# Altium project MB1360.PrjPcb (part 1 of 2)
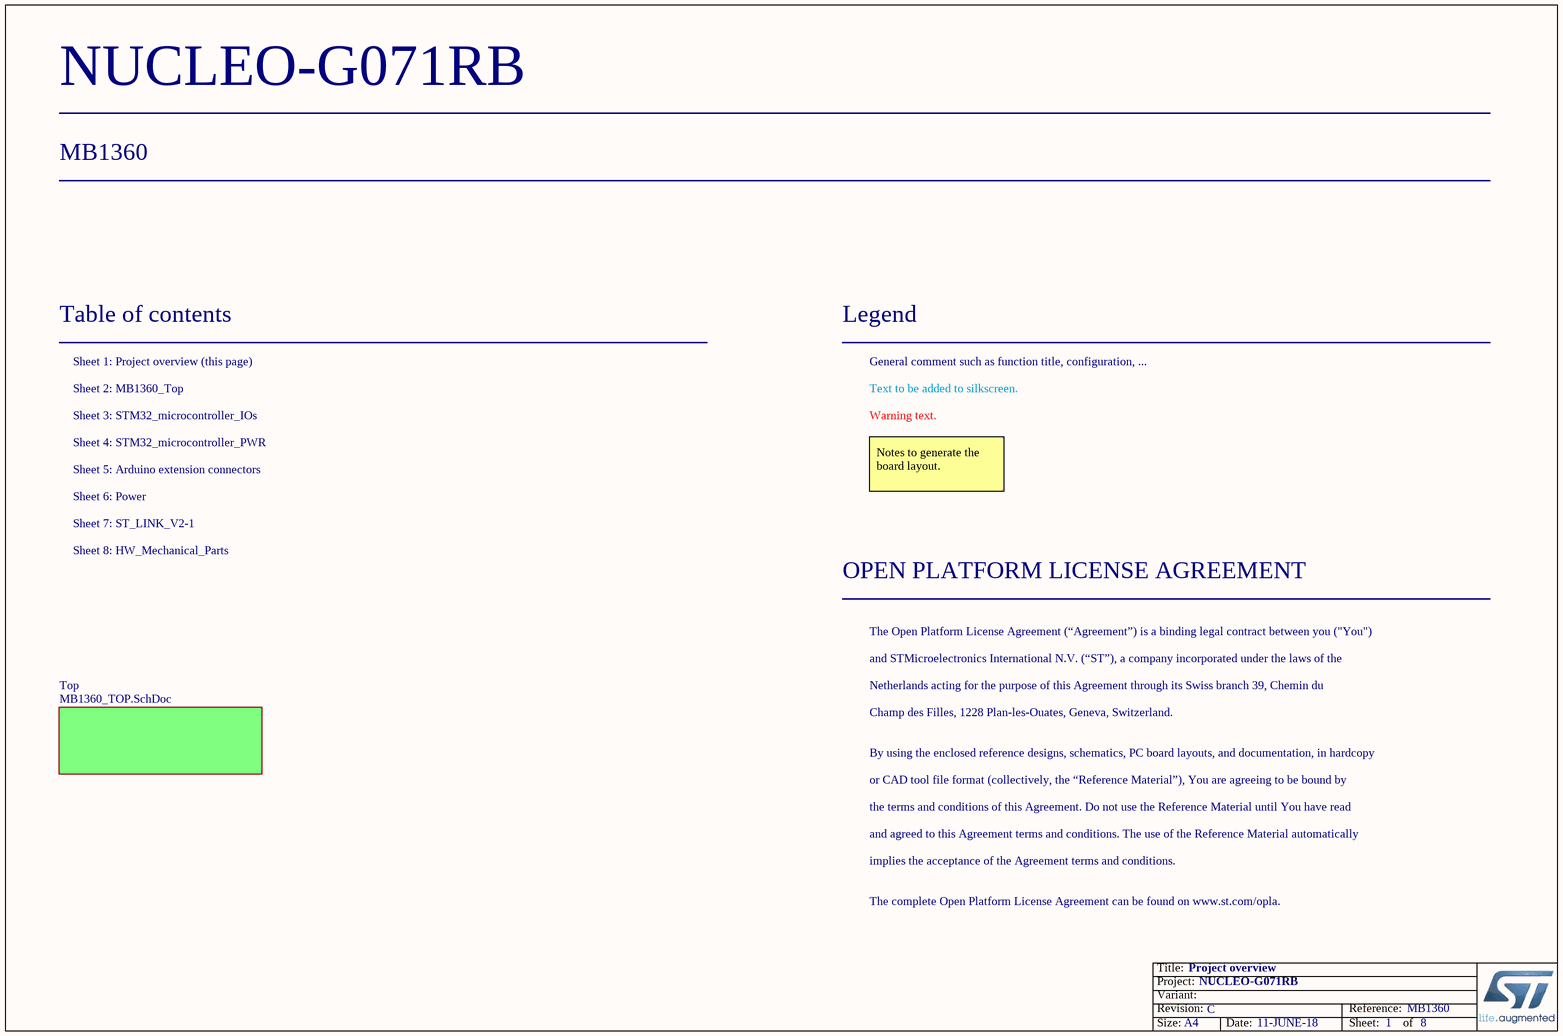
[diagram p0: Project_overview.SchDoc]
Board_Assembly_Revision: 01; Board_Document_Date: 11-JUNE-18; Board_Name: NUCLEO-G071RB; Board_PCB_Revision: C; Board_Reference: MB1360
8 sheets, 149 parts. Net scope: flat (ports and power ports of the same name join across sheets).
Board file: MB1360.PcbDoc
Sheets:
  Project_overview.SchDoc
    Top = MB1360_TOP.SchDoc
      ST_LINK_V2-1 = ST_LINK_V2-1.SchDoc
      Connectors = Arduino_extension_connectors.SchDoc
      MCU = STM32_microcontroller_IOs.SchDoc
      Power = Power.SchDoc
      STM32_microcontroller_power = STM32_microcontroller_power.SchDoc
      HW_Mechanical_Parts = HW_Mechanical_Parts.SchDoc

## Sheet Project_overview.SchDoc: Project overview
size A4; Date: Not used; ApprovedBy: Not used; CheckedBy: Not used; Author: Not used; CompanyName: STMicroelectronics; DrawnBy: Not used; Engineer: Not used; Organization: Not used; Address1: Not used; Address2: Not used; Address3: Not used; Address4: Not used; DocumentNumber: 1; Revision: Not used; SheetNumber: 1; SheetTotal: 8; CurrentTime: Not used; CurrentDate: Not used; Time: Not used; DocumentFullPathAndName: Not used; DocumentName: Not used; ModifiedDate: Not used; ImagePath: Not used; ProjectName: Not used; Application_BuildNumber: Not used

### Sub-sheets
Top = MB1360_TOP.SchDoc: no entries

### Notes on the sheet
- Table of contents
- Sheet 1: Project overview (this page)
- Legend
- General comment such as function title, configuration, ...
- Sheet 2: MB1360_Top
- Sheet 4: STM32_microcontroller_PWR
- Sheet 3: STM32_microcontroller_IOs
- Text to be added to silkscreen.
- Warning text.
- Sheet 6: Power
- Sheet 5: Arduino extension connectors
- Notes to generate the board layout.
- Sheet 7: ST_LINK_V2-1
- Sheet 8: HW_Mechanical_Parts
- OPEN PLATFORM LICENSE AGREEMENT
- The Open Platform License Agreement (“Agreement”) is a binding legal contract between you ("You")
- and STMicroelectronics International N.V. (“ST”), a company incorporated under the laws of the
- Netherlands acting for the purpose of this Agreement through its Swiss branch 39, Chemin du
- Champ des Filles, 1228 Plan-les-Ouates, Geneva, Switzerland.
- By using the enclosed reference designs, schematics, PC board layouts, and documentation, in hardcopy
- or CAD tool file format (collectively, the “Reference Material”), You are agreeing to be bound by
- the terms and conditions of this Agreement. Do not use the Reference Material until You have read
- and agreed to this Agreement terms and conditions. The use of the Reference Material automatically
- implies the acceptance of the Agreement terms and conditions.
- The complete Open Platform License Agreement can be found on www.st.com/opla.
- Title:
- Project:
- Size:
- Revision:
- Variant:
- A4
- Date:
- Reference:
- Sheet:
- of

## Sheet MB1360_TOP.SchDoc: TOP
size A4; CompanyName: STMicroelectronics; Organization: Microcontrollers Division; SheetNumber: 2; SheetTotal: 8
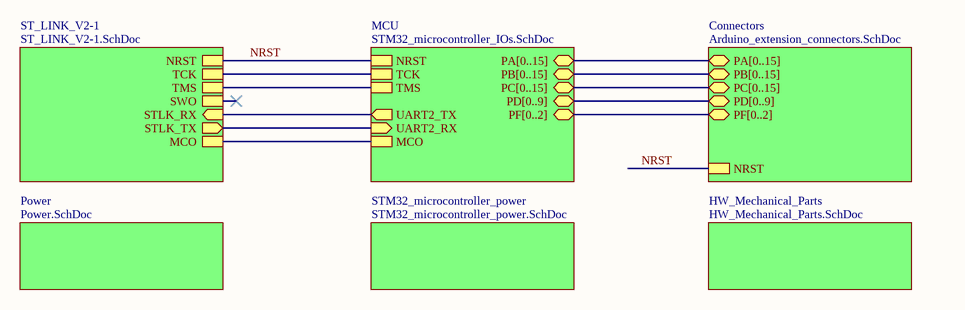
[diagram p1: MB1360_TOP.SchDoc]

### Sub-sheets
Connectors = Arduino_extension_connectors.SchDoc: PA[0..15] (bidir), PB[0..15] (bidir), PC[0..15] (bidir), NRST, PD[0..9], PF[0..2] (bidir)
HW_Mechanical_Parts = HW_Mechanical_Parts.SchDoc: no entries
MCU = STM32_microcontroller_IOs.SchDoc: NRST, MCO, UART2_RX (in), UART2_TX (out), PA[0..15] (bidir), PB[0..15] (bidir), PC[0..15] (bidir), TCK, TMS, PD[0..9], PF[0..2] (bidir)
Power = Power.SchDoc: no entries
ST_LINK_V2-1 = ST_LINK_V2-1.SchDoc: TMS, TCK, MCO, NRST, STLK_RX (in), STLK_TX (out), SWO
STM32_microcontroller_power = STM32_microcontroller_power.SchDoc: no entries

### Nets
NRST: sheet ST_LINK_V2-1/NRST, sheet Connectors/NRST, sheet MCU/NRST
(unnamed): sheet ST_LINK_V2-1/TMS, sheet MCU/TMS
(unnamed): sheet ST_LINK_V2-1/TCK, sheet MCU/TCK
(unnamed): sheet ST_LINK_V2-1/MCO, sheet MCU/MCO
(unnamed): sheet ST_LINK_V2-1/STLK_RX, sheet MCU/UART2_TX
(unnamed): sheet ST_LINK_V2-1/STLK_TX, sheet MCU/UART2_RX

### Buses and harness runs
bus sheet Connectors/PA[0..15] = sheet MCU/PA[0..15]
bus sheet Connectors/PB[0..15] = sheet MCU/PB[0..15]
bus sheet Connectors/PC[0..15] = sheet MCU/PC[0..15]
bus sheet Connectors/PD[0..9] = sheet MCU/PD[0..9]
bus sheet Connectors/PF[0..2] = sheet MCU/PF[0..2]

### Notes on the sheet
- Title:
- Project:
- Size:
- Revision:
- Variant:
- A4
- Date:
- Reference:
- Sheet:
- of

## Sheet ST_LINK_V2-1.SchDoc: ST_LINK_V2-1
size A4; CompanyName: STMicroelectronics; Organization: Microcontrollers Division; SheetNumber: 7; SheetTotal: 8
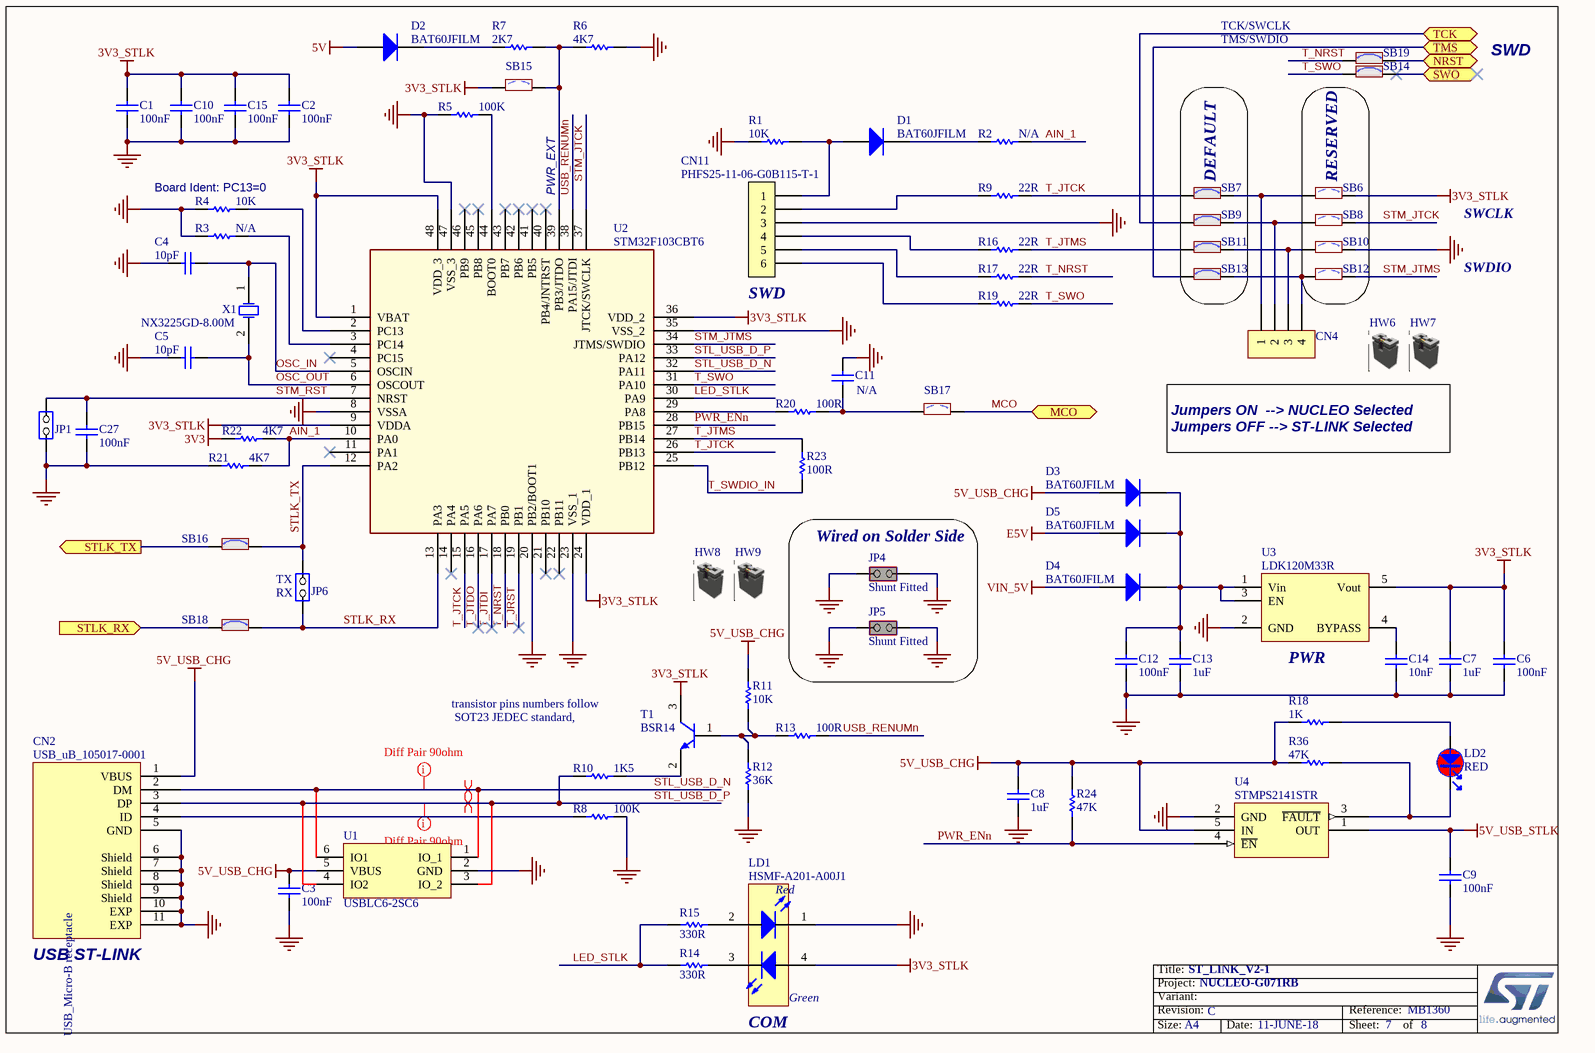
[diagram p2: ST_LINK_V2-1.SchDoc]

### Parts
C1  value 100nF  [C0603]  (hidden comment: Capacitor)
C2  value 100nF  [C0603]  (hidden comment: Capacitor)
C3  value 100nF  [C0603]  (hidden comment: Capacitor)
C4  value 10pF  [C0603]  (hidden comment: Capacitor)
C5  value 10pF  [C0603]  (hidden comment: Capacitor)
C6  value 100nF  [C0603]  (hidden comment: Capacitor)
C7  value 1uF  [C0603]  (hidden comment: Capacitor)
C8  value 1uF  [C0603]  (hidden comment: Capacitor)
C9  value 100nF  [C0603]  (hidden comment: Capacitor)
C10  value 100nF  [C0603]  (hidden comment: Capacitor)
C11  N/A  [C0603]
C12  value 100nF  [C0603]  (hidden comment: Capacitor)
C13  value 1uF  [C0603]  (hidden comment: Capacitor)
C14  value 10nF  [C0603]  (hidden comment: Capacitor)
C15  value 100nF  [C0603]  (hidden comment: Capacitor)
C27  value 100nF  [C0603]  (hidden comment: Capacitor)
CN2  value USB_uB_105017-0001  [CON_USBMICROB_MOLEX_105017-0001_H2P90]  (hidden comment: USB_uB_105017.0001)
CN4  Header 4x1  [CON_988-JIUBABA_PHFS25-11-04-G0B115-T-1]  (value not drawn)
CN11  Manufacturer_Part_Number: PHFS25-11-06-G0B115-T-1  [CON_988-JIUBABA_PHFS25-11-06-G0B115-T-1]  (hidden comment: Header 6x1)
D1  BAT60JFILM  [DIO_SOD323]
D2  BAT60JFILM  [DIO_SOD323]
D3  BAT60JFILM  [DIO_SOD323]
D4  BAT60JFILM  [DIO_SOD323]
D5  BAT60JFILM  [DIO_SOD323]
HW6  Shunt 2.54mm  [N/A]  (value not drawn)  (mechanical)
HW7  Shunt 2.54mm  [N/A]  (value not drawn)  (mechanical)
HW8  Shunt 2.54mm  [N/A]  (value not drawn)  (mechanical)
HW9  Shunt 2.54mm  [N/A]  (value not drawn)  (mechanical)
JP1  Jumper Header 2x1  [CON_SAMTEC_TSW-102-07-G-S]  (value not drawn)
JP4  Shunt Fitted  [CON_SAMTEC_TSW-102-07-G-S]
JP5  Shunt Fitted  [CON_SAMTEC_TSW-102-07-G-S]
JP6  Jumper Header 2x1  [CON_SAMTEC_TSW-102-07-G-S]  (value not drawn)
LD1  Manufacturer_Part_Number: HSMF-A201-A00J1  [LED_BI-GR_HSMF-A201-A00J1]  (hidden comment: LD_BICOLOR_CMS)
LD2  value RED  [LED_0603_RED]  (hidden comment: LED_red)
R1  value 10K  [R0603]  (hidden comment: Resistor)
R2  N/A  [R0603]
R3  N/A  [R0603]
R4  value 10K  [R0603]  (hidden comment: Resistor)
R5  value 100K  [R0603]  (hidden comment: Resistor)
R6  value 4K7  [R0603]  (hidden comment: Resistor)
R7  value 2K7  [R0603]  (hidden comment: Resistor)
R8  value 100K  [R0603]  (hidden comment: Resistor)
R9  value 22R  [R0603]  (hidden comment: Resistor)
R10  value 1K5  [R0603]  (hidden comment: Resistor)
R11  value 10K  [R0603]  (hidden comment: Resistor)
R12  value 36K  [R0603]  (hidden comment: Resistor)
R13  value 100R  [R0603]  (hidden comment: Resistor)
R14  value 330R  [R0603]  (hidden comment: Resistor)
R15  value 330R  [R0603]  (hidden comment: Resistor)
R16  value 22R  [R0603]  (hidden comment: Resistor)
R17  value 22R  [R0603]  (hidden comment: Resistor)
R18  value 1K  [R0603]  (hidden comment: Resistor)
R19  value 22R  [R0603]  (hidden comment: Resistor)
R20  value 100R  [R0603]  (hidden comment: Resistor)
R21  value 4K7  [R0603]  (hidden comment: Resistor)
R22  value 4K7  [R0603]  (hidden comment: Resistor)
R23  value 100R  [R0603]  (hidden comment: Resistor)
R24  value 47K  [R0603]  (hidden comment: Resistor)
R36  value 47K  [R0603]  (hidden comment: Resistor)
SB6  SB_OFF  [SOLDER-BRIDGE_R0603-0R]  (value not drawn)
SB7  SB_ON  [SOLDER-BRIDGE_R0603-0R]  (value not drawn)
SB8  SB_OFF  [SOLDER-BRIDGE_R0603-0R]  (value not drawn)
SB9  SB_ON  [SOLDER-BRIDGE_R0603-0R]  (value not drawn)
SB10  SB_OFF  [SOLDER-BRIDGE_R0603-0R]  (value not drawn)
SB11  SB_ON  [SOLDER-BRIDGE_R0603-0R]  (value not drawn)
SB12  SB_OFF  [SOLDER-BRIDGE_R0603-0R]  (value not drawn)
SB13  SB_ON  [SOLDER-BRIDGE_R0603-0R]  (value not drawn)
SB14  SB_ON  [SOLDER-BRIDGE_R0603-0R]  (value not drawn)
SB15  SB_OFF  [SOLDER-BRIDGE_R0603-0R]  (value not drawn)
SB16  SB_ON  [SOLDER-BRIDGE_R0603-0R]  (value not drawn)
SB17  SB_OFF  [SOLDER-BRIDGE_R0603-0R]  (value not drawn)
SB18  SB_ON  [SOLDER-BRIDGE_R0603-0R]  (value not drawn)
SB19  SB_ON  [SOLDER-BRIDGE_R0603-0R]  (value not drawn)
T1  Manufacturer_Part_Number: BSR14  [NPN_SOT23]  (hidden comment: 9013-SOT23)
U1  USBLC6-2SC6  [ESD_SOT23-6L]
U2  STM32F103CBT6  [ICC_LQFP48_7X7_P050]
U3  LDK120M33R  [REG_SOT23-5L]
U4  value STMPS2141STR  [MOS_SOT23-5L]  (hidden comment: DFN8 and SO8 are mixed in a single footprint allowing to swap according to components availability)
X1  value NX3225GD-8.00M  [CRY_NX3225GD_2P]  (hidden comment: XTAL_8M_NX3225GD)

### Blocks framed on the sheet
DEFAULT: SB7 SB9 SB11 SB13
RESERVED: SB6 SB8 SB10 SB12
Wired on Solder Side: JP4 JP5

### Ports
MCO, NRST, STLK_RX (in), STLK_TX (out), SWO, TCK, TMS

### Nets
3V3: R22.1
3V3_STLK: C1.2 C2.2 C6.2 C7.2 C10.2 C15.2 LD1.4(YellowGreen_anode) SB6.2 SB15.1 T1.3(C) U2.1(VBAT) U2.9(VDDA) U2.24(VDD_1) U2.36(VDD_2) U2.48(VDD_3) U3.5(Vout)
5V: D2.1(A)
5V_USB_CHG: C3.2 C8.1 CN2.1(VBUS) D3.1(A) R11.2 R18.2 R24.2 R36.2 U1.5(VBUS) U4.5(IN)
5V_USB_STLK: C9.2 U4.1(OUT)
E5V: D5.1(A)
GND: C1.1 C2.1 C3.1 C4.1 C5.1 C6.1 C7.1 C8.2 C9.1 C10.1 C11.2 C12.1 C13.1 C14.1 C15.1 C27.2 CN2.5(GND) CN2.6(Shield) CN2.7(Shield) CN2.8(Shield) CN2.9(Shield) CN2.10(EXP) CN2.11(EXP) CN11.3 JP1.2(NO) JP4.1(COMMON) JP4.2(NO) JP5.1(COMMON) JP5.2(NO) LD1.1(RED_cathode) R1.2 R3.1 R4.1 R5.1 R6.2 R8.2 R12.1 R21.1 SB10.2 U1.2(GND) U2.8(VSSA) U2.20(PB2/BOOT1) U2.23(VSS_1) U2.35(VSS_2) U2.47(VSS_3) U3.2(GND) U4.2(GND)
VIN_5V: D4.1(A)
AIN_1: R2.2 R21.2 R22.2 U2.10(PA0)
LED_STLK: R14.1 R15.1 U2.30(PA9)
MCO: SB17.2 ; port MCO
NRST: SB19.2 ; port NRST
OSC_IN: C4.2 U2.5(OSCIN) X1.1(OSC1)
OSC_OUT: C5.2 U2.6(OSCOUT) X1.2(OSC2)
PA13: SB13.1 ; port TMS
PA14: SB9.1 ; port TCK
PWR_ENn: R24.1 U2.28(PB15) U4.4(~{EN})
STL_USB_D_N: CN2.2(DM) U1.1(IO_1) U1.6(IO1) U2.32(PA11)
STL_USB_D_P: CN2.3(DP) R10.1 U1.3(IO_2) U1.4(IO2) U2.33(PA12)
STLK_RX: JP6.1(COMMON) SB18.2 U2.13(PA3)
STLK_TX: JP6.2(NO) SB16.2 U2.12(PA2)
STM_JTCK: SB8.2 U2.37(JTCK/SWCLK)
STM_JTMS: SB12.2 U2.34(JTMS/SWDIO)
STM_RST: C27.1 JP1.1(COMMON) U2.7(NRST)
T_JRST: U2.19(PB1)
T_JTCK: R9.2 SB7.1 U2.15(PA5) U2.26(PB13)
T_JTDI: U2.17(PA7)
T_JTDO: U2.16(PA6)
T_JTMS: R16.2 R23.2 SB11.1 U2.27(PB14)
T_NRST: R17.2 SB19.1 U2.18(PB0)
T_SWDIO_IN: R23.1 U2.25(PB12)
T_SWO: R19.2 SB14.1 U2.31(PA10)
USB_RENUMn: R13.2 U2.38(PA15/JTDI)
NetC11_1: C11.1 R20.2 SB17.1
NetC12_2: C12.2 C13.2 D3.2(K) D4.2(K) D5.2(K) U3.1(Vin) U3.3(EN)
NetC14_2: C14.2 U3.4(BYPASS)
NetCN2_4: CN2.4(ID) R8.1
NetCN4_1: CN4.1 SB6.1 SB7.2
NetCN4_2: CN4.2 SB8.1 SB9.2
NetCN4_3: CN4.3 SB10.1 SB11.2
NetCN4_4: CN4.4 SB12.1 SB13.2
NetCN11_1: CN11.1 D1.1(A) R1.1
NetCN11_2: CN11.2 R9.1
NetCN11_4: CN11.4 R16.1
NetCN11_5: CN11.5 R17.1
NetCN11_6: CN11.6 R19.1
NetD1_2: D1.2(K) R2.1
NetD2_2: D2.2(K) R7.1
NetLD1_2: LD1.2(Red_anode) R15.2
NetLD1_3: LD1.3(YellowGreen_cathode) R14.2
NetLD2_1: LD2.1 R18.1
NetLD2_2: LD2.2 R36.1 U4.3(~{FAULT})
NetR3_2: R3.2 U2.3(PC14)
NetR4_2: R4.2 U2.2(PC13)
NetR5_2: R5.2 U2.44(BOOT0)
NetR6_1: R6.1 R7.2 SB15.2 U2.39(PB3/JTDO)
NetR10_2: R10.2 T1.2(E)
NetR11_1: R11.1 R12.2 R13.1 T1.1(B)
NetR20_1: R20.1 U2.29(PA8)
NetSB14_2: SB14.2 ; port SWO
NetSB16_1: SB16.1 ; port STLK_TX
NetSB18_1: SB18.1 ; port STLK_RX

Not connected (* = marked no-connect by the designer): U2 4(PC15)* 11(PA1)* 14(PA4)* 21(PB10)* 22(PB11)* 40(PB4/JNTRST)* 41(PB5)* 42(PB6)* 43(PB7)* 45(PB8)* 46(PB9)*

### Layout directives
mark named Diff Pair 90ohm: STL_USB_D_N, STL_USB_D_P
differential pair: STL_USB_D_N, STL_USB_D_P

### Notes on the sheet
- TCK/SWCLK
- TMS/SWDIO
- SWD
- (near R4) Board Ident: PC13=0
- PWR_EXT
- SWCLK
- (near CN11) SWD
- SWDIO
- Jumpers ON  --> NUCLEO Selected
  Jumpers OFF --> ST-LINK Selected
- (near JP6) TX
- (near JP6) RX
- (near U3) PWR
- (near T1) transistor pins numbers follow
  SOT23 JEDEC standard,
- (near CN2) USB ST-LINK
- COM
- Title:
- Project:
- Size:
- Revision:
- Variant:
- A4
- Date:
- Reference:
- Sheet:
- of
- (in symbol MCD-00028) USB_Micro-B receptacle
- (in symbol MCD-00051) Red; Green

### Library data of the parts
C1-C3 C6 C9 C10 C12 C15 C27 = MCD-00211: Capacitor, MLCC, 100nF, 16V, X7R, 10%, 0603, T=0,8mm; Manufacturer_Part_Number: CC0603KRX7R7BB104; Manufacturer: YAGEO; Provided_By: Subcon; Initial_Board_Reference: mb1319; Internal_Part_Number: MCD-00211; Status: Released; Part_Type: Capacitor; Package: C0603; ComponentLink1Description: Yageo_Capacitor_X7R-series.pdf; ComponentLink1URL: http://tunmcdsvn.tun.st.com/Component_Datasheet_Library/Trunk/Capacitors/Yageo_Capacitor_X7R-series.pdf; ECCN_US: n/a; ECCN_EU: n/a
C4 C5 = MCD-00637: Capacitor, MLCC, 10pF, 50V, NPO, 5%, 0603, T=0,8mm; Manufacturer_Part_Number: CC0603JRNPO9BN100; Manufacturer: YAGEO; Provided_By: subcon; Initial_Board_Reference: mb1319; Internal_Part_Number: MCD-00637; Status: Released; Part_Type: Capacitor; Package: C0603; ComponentLink1Description: Yageo_Capacitor_NP0_16V-to-50V.pdf; ComponentLink1URL: http://tunmcdsvn.tun.st.com/Component_Datasheet_Library/Trunk/Capacitors/Yageo_Capacitor_NP0_16V-to-50V.pdf; ECCN_US: n/a; ECCN_EU: n/a
C7 C13 = MCD-00010: Capacitor, MLCC, 1uF, 16V, X5R, 10%, 0603, T=0,8mm; Manufacturer_Part_Number: CC0603KRX5R7BB105; Manufacturer: YAGEO; Provided_By: Subcon; Initial_Board_Reference: mb1274; Internal_Part_Number: MCD-00010; Status: Released; Part_Type: Capacitor; Package: C0603; ComponentLink1Description: Yageo_Capacitor_X5R-series.pdf; ComponentLink1URL: http://tunmcdsvn.tun.st.com/Component_Datasheet_Library/Trunk/Capacitors/Yageo_Capacitor_X5R-series.pdf; ECCN_US: n/a; ECCN_EU: n/a
C8 = MCD-00238: Capacitor, MLCC, 1uF, 6V3, X5R, 10%, 0603, T=0,8mm; Manufacturer_Part_Number: CC0603KRX5R5BB105; Manufacturer: YAGEO; Provided_By: Subcon; Initial_Board_Reference: mb1319; Internal_Part_Number: MCD-00238; ECCN_US: n/a; ECCN_EU: n/a; ComponentLink1Description: Yageo_Capacitor_X5R-series.pdf; Status: Released; Part_Type: Capacitor; Package: C0603; ComponentLink1URL: http://tunmcdsvn.tun.st.com/Component_Datasheet_Library/Trunk/Capacitors/Yageo_Capacitor_X5R-series.pdf
C11 = MCD-00638: Capacitor, MLCC, 20pF, 50V, NPO, 5%, 0603, T=0,8mm; Manufacturer_Part_Number: CC0603JRNPO9BN200; Manufacturer: YAGEO; Provided_By: Subcon; Initial_Board_Reference: mb1319; Internal_Part_Number: MCD-00638; Value: 20pF; Status: Released; Part_Type: Capacitor; Package: C0603; ComponentLink1Description: Yageo_Capacitor_NP0_16V-to-50V.pdf; ECCN_US: n/a; ECCN_EU: n/a; ComponentLink1URL: http://tunmcdsvn.tun.st.com/Component_Datasheet_Library/Trunk/Capacitors/Yageo_Capacitor_NP0_16V-to-50V.pdf
C14 = MCD-00017: Capacitor, MLCC, 10nF, 50V, X7R, 10%, 0603, T=0.8mm; Manufacturer_Part_Number: CC0603KRX7R9BB103; Manufacturer: YAGEO; Provided_By: Subcon; Initial_Board_Reference: mb1274; Internal_Part_Number: MCD-00017; Status: Released; Part_Type: Capacitor; Package: C0603; ComponentLink1Description: Yageo_Capacitor_X7R-series.pdf; ComponentLink1URL: http://tunmcdsvn.tun.st.com/Component_Datasheet_Library/Trunk/Capacitors/Yageo_Capacitor_X7R-series.pdf; ECCN_US: n/a; ECCN_EU: n/a
CN2 = MCD-00028: USB-MICRO-B, 0.65mm, RA, SMT, Bottom Mount,; Part_Type: Connector; Manufacturer_Part_Number: 1050170001; Manufacturer: MOLEX; Provided_By: Subcon; Initial_Board_Reference: mb1274; Internal_Part_Number: MCD-00028; Status: Released; ComponentLink1Description: Molex_Connector-USB-microB_105017-0001.pdf; ComponentLink1URL: http://tunmcdsvn.tun.st.com/Component_Datasheet_Library/Trunk/Connectors/Molex_Connector-USB-microB_105017-0001.pdf; ECCN_US: n/a; ECCN_EU: n/a
CN4 = MCD-00313: Header, 4x1, 2.54mm, VR, TH, Height 6mm/3mm; Part_Type: Connector; Manufacturer_Part_Number: PHFS25-11-04-G0B115-T-1; Manufacturer: JIUBABA; Provided_By: Subcon; Initial_Board_Reference: mb1311; Internal_Part_Number: MCD-00313; Value: Header 4x1; Status: Released; ComponentLink1Description: Juibaba_PHFS25-11XXXXXXXXXX.pdf; ComponentLink1URL: http://tunmcdsvn.tun.st.com/Component_Datasheet_Library/Trunk/Connectors/Juibaba_PHFS25-11XXXXXXXXXX.pdf; ECCN_US: n/a; ECCN_EU: n/a
CN11 = MCD-00316: Header, 6x1, 2.54mm, VR, TH, Height 6mm/3mm; Part_Type: Connector; Manufacturer: JIUBABA; Value: Header 1x6; Provided_By: Subcon; Initial_Board_Reference: mb1311; Internal_Part_Number: MCD-00316; Status: Released; ComponentLink1Description: Juibaba_PHFS25-11XXXXXXXXXX.pdf; ComponentLink1URL: http://tunmcdsvn.tun.st.com/Component_Datasheet_Library/Trunk/Connectors/Juibaba_PHFS25-11XXXXXXXXXX.pdf; ECCN_US: n/a; ECCN_EU: n/a
D1 D3-D5 = MCD-00034: Part_Type: Diode; Manufacturer: STMICROELECTRONICS; ECCN_US: EAR99; ECCN_EU: NEC; Provided_By: Subcon; Initial_Board_Reference: mb1274; Internal_Part_Number: MCD-00034; Value: BAT60JFILM; Status: Released; Manufacturer_Part_Number: BAT60JFILM; ComponentLink1Description: STM_Diode_BAT60JFILM-SOD323.pdf; ComponentLink1URL: http://tunmcdsvn.tun.st.com/Component_Datasheet_Library/Trunk/Diodes/STM_Diode_BAT60JFILM-SOD323.pdf
D2 = MCD-00034: Manufacturer: STMICROELECTRONICS; Part_Type: Diode; ECCN_US: EAR99; ECCN_EU: NEC; Provided_By: Subcon; Initial_Board_Reference: mb1274; Internal_Part_Number: MCD-00034; Value: BAT60JFILM; Manufacturer_Part_Number: BAT60JFILM; ComponentLink1Description: STM_Diode_BAT60JFILM-SOD323.pdf; Status: Released
HW6-HW9 = MCD-00043: SHUNT 2.54mm BLACK; Manufacturer_Part_Number: SNT-100-BK-G; Manufacturer: SAMTEC; Provided_By: Subcon; Internal_Part_Number: MCD-00043; PartType: Mechanical; ECCN_US: n/a; ECCN_EU: n/a; ComponentLink1Description: Samtec_Shunt_Jumper_SNT100.pdf
JP1 JP6 = MCD-00045: Header, 2x1, 2,54mm, VR, TH, Height 5.84mm/2.54mm; Part_Type: Connector; Manufacturer_Part_Number: TSW-102-07-x-S; Manufacturer: SAMTEC; Value: Jumper_Header_2x1; Provided_By: Subcon; Initial_Board_Reference: mb1274; Internal_Part_Number: MCD-00045; Status: Released; ComponentLink1Description: Samtec_connector_TSW-HTSW-series.pdf; ComponentLink1URL: http://tunmcdsvn.tun.st.com/Component_Datasheet_Library/Trunk/Connectors/Samtec_connector_TSW-HTSW-series.pdf; ECCN_US: n/a; ECCN_EU: n/a
JP4 JP5 = MCD-00683: Header, 2x1, 2,54mm, VR, TH, Height 5.84mm/2.54mm - Shunt Fitted by default; Part_Type: Connector; Manufacturer_Part_Number: TSW-102-07-x-S; Manufacturer: SAMTEC; Provided_By: Subcon; Initial_Board_Reference: MB1331; Internal_Part_Number: MCD-00683; Value: Shunt Fitted; Status: Released; ComponentLink1Description: Samtec_connector_TSW-HTSW-series.pdf; ComponentLink1URL: http://tunmcdsvn.tun.st.com/Component_Datasheet_Library/Trunk/Connectors/Samtec_TSW-HTSW-series; ECCN_US: n/a; ECCN_EU: n/a
LD1 = MCD-00051: LED Bicolor; Part_Type: Display; Manufacturer: AVAGO TECHNOLOGIES; Alternate_Manufacturer_Part_Number: LE-RGW35280; Alternate_Manufacturer: EVERLUCK; ECCN_US: EAR99; ECCN_EU: NEC; Provided_By: Subcon; Initial_Board_Reference: mb1274; Internal_Part_Number: MCD-00051; Value: LD_BICOLOR_CMS; Status: Released; ComponentLink1Description: Avago_LED-SMC_HSMx-A2xx-02Feb2012.pdf; ComponentLink1URL: http://tunmcdsvn.tun.st.com/Component_Datasheet_Library/Trunk/display/Avago_LED-SMC_HSMx-A2xx-02Feb2012.pdf
LD2 = MCD-00049: LED, Red, 0603; Manufacturer_Part_Number: 19-213-R6C-AP1Q2B/3T; Manufacturer: EVERLIGHT; Part_Type: Display; ECCN_US: EAR99; ECCN_EU: NEC; Provided_By: Subcon; Initial_Board_Reference: mb1274; Internal_Part_Number: MCD-00049; ComponentLink1Description: Everlight_SMD-LED-RED_19-213-R6C-AP1Q2B-3T-V3.doc.pdf; Status: Released; ComponentLink1URL: http://tunmcdsvn.tun.st.com/Component_Datasheet_Library/Trunk/display/Everlight_SMD-LED-RED_19-213-R6C-AP1Q2B-3T-V3.doc.pdf
R1 R3 R4 R11 = MCD-00220: Resistor,10K,0603,1%,1/10W; Manufacturer_Part_Number: RC0603FR-0710KL; Manufacturer: YAGEO; Provided_By: Subcon; Initial_Board_Reference: mb1319; Internal_Part_Number: MCD-00220; Status: Released; Part_Type: Resistor; Package: R0603; ComponentLink1Description: Yageo_Resistor_RC0603-series.pdf; ComponentLink1URL: http://tunmcdsvn.tun.st.com/Component_Datasheet_Library/Trunk/Resistors/Yageo_Resistor_RC0603-series.pdf; ECCN_US: n/a; ECCN_EU: n/a
  R3: Value: 10K
R2 R9 R16 R17 R19 = MCD-00066: Resistor,22R,0603,1%,1/10W; Manufacturer_Part_Number: RC0603FR-0722RL; Manufacturer: YAGEO; Provided_By: Subcon; Initial_Board_Reference: mb1274; Internal_Part_Number: MCD-00066; Status: Released; Part_Type: Resistor; Package: R0603; ComponentLink1Description: Yageo_Resistor_RC0603-series.pdf; ComponentLink1URL: http://tunmcdsvn.tun.st.com/Component_Datasheet_Library/Trunk/Resistors/Yageo_Resistor_RC0603-series.pdf; ECCN_US: n/a; ECCN_EU: n/a
  R2: Value: 22R
R5 R8 = MCD-00223: Resistor,100K,0603,1%,1/10W; Manufacturer_Part_Number: RC0603FR-07100KL; Manufacturer: YAGEO; Provided_By: Subcon; Initial_Board_Reference: mb1319; Internal_Part_Number: MCD-00223; Status: Released; Part_Type: Resistor; Package: R0603; ComponentLink1Description: Yageo_Resistor_RC0603-series.pdf; ComponentLink1URL: http://tunmcdsvn.tun.st.com/Component_Datasheet_Library/Trunk/Resistors/Yageo_Resistor_RC0603-series.pdf; ECCN_US: n/a; ECCN_EU: n/a
R6 R21 R22 = MCD-00219: Resistor,4K7,0603,1%,1/10W; Manufacturer_Part_Number: RC0603FR-074K7L; Manufacturer: YAGEO; Provided_By: Subcon; Initial_Board_Reference: mb1319; Internal_Part_Number: MCD-00219; Status: Released; Part_Type: Resistor; Package: R0603; ComponentLink1Description: Yageo_Resistor_RC0603-series.pdf; ComponentLink1URL: http://tunmcdsvn.tun.st.com/Component_Datasheet_Library/Trunk/Resistors/Yageo_Resistor_RC0603-series.pdf; ECCN_US: n/a; ECCN_EU: n/a
R7 = MCD-00218: Resistor,2K7,0603,1%,1/10W; Manufacturer_Part_Number: RC0603FR-072K7L; Manufacturer: YAGEO; Provided_By: Subcon; Initial_Board_Reference: mb1319; Internal_Part_Number: MCD-00218; Status: Released; Part_Type: Resistor; Package: R0603; ComponentLink1Description: Yageo_Resistor_RC0603-series.pdf; ComponentLink1URL: http://tunmcdsvn.tun.st.com/Component_Datasheet_Library/Trunk/Resistors/Yageo_Resistor_RC0603-series.pdf; ECCN_US: n/a; ECCN_EU: n/a
R10 = MCD-00217: Resistor,1K5,0603,1%,1/10W; Manufacturer_Part_Number: RC0603FR-071K5L; Manufacturer: YAGEO; Provided_By: Subcon; Initial_Board_Reference: mb1319; Internal_Part_Number: MCD-00217; Status: Released; Part_Type: Resistor; Package: R0603; ComponentLink1Description: Yageo_Resistor_RC0603-series.pdf; ComponentLink1URL: http://tunmcdsvn.tun.st.com/Component_Datasheet_Library/Trunk/Resistors/Yageo_Resistor_RC0603-series.pdf; ECCN_US: n/a; ECCN_EU: n/a
R12 = MCD-00221: Resistor,36K,0603,1%,1/10W; Manufacturer_Part_Number: RC0603FR-0736KL; Manufacturer: YAGEO; Provided_By: Subcon; Initial_Board_Reference: mb1319; Internal_Part_Number: MCD-00221; Status: Released; Part_Type: Resistor; Package: R0603; ComponentLink1Description: Yageo_Resistor_RC0603-series.pdf; ComponentLink1URL: http://tunmcdsvn.tun.st.com/Component_Datasheet_Library/Trunk/Resistors/Yageo_Resistor_RC0603-series.pdf; ECCN_US: n/a; ECCN_EU: n/a
R13 R20 R23 = MCD-00224: Resistor,100R,0603,1%,1/10W; Manufacturer_Part_Number: RC0603FR-07100RL; Manufacturer: YAGEO; Provided_By: Subcon; Initial_Board_Reference: mb1319; Internal_Part_Number: MCD-00224; Status: Released; Part_Type: Resistor; Package: R0603; ComponentLink1Description: Yageo_Resistor_RC0603-series.pdf; ComponentLink1URL: http://tunmcdsvn.tun.st.com/Component_Datasheet_Library/Trunk/Resistors/Yageo_Resistor_RC0603-series.pdf; ECCN_US: n/a; ECCN_EU: n/a
R14 R15 = MCD-00197: Resistor,330R,0603,1%,1/10W; Manufacturer_Part_Number: RC0603FR-07330RL; Manufacturer: YAGEO; Provided_By: Subcon; Internal_Part_Number: MCD-00197; Status: Released; Part_Type: Resistor; Package: R0603; ComponentLink1Description: Yageo_Resistor_RC0603-series.pdf; ComponentLink1URL: http://tunmcdsvn.tun.st.com/Component_Datasheet_Library/Trunk/Resistors/Yageo_Resistor_RC0603-series; ECCN_US: n/a; ECCN_EU: n/a
R18 = MCD-00070: Resistor,1K,0603,1%,1/10W; Manufacturer_Part_Number: RC0603FR-071KL; Manufacturer: YAGEO; Provided_By: Subcon; Initial_Board_Reference: mb1274; Internal_Part_Number: MCD-00070; Status: Released; Part_Type: Resistor; Package: R0603; ComponentLink1Description: Yageo_Resistor_RC0603-series.pdf; ComponentLink1URL: http://tunmcdsvn.tun.st.com/Component_Datasheet_Library/Trunk/Resistors/Yageo_Resistor_RC0603-series.pdf; ECCN_US: n/a; ECCN_EU: n/a
R24 R36 = MCD-00222: Resistor,47K,0603,1%,1/10W; Manufacturer_Part_Number: RC0603FR-0747KL; Manufacturer: YAGEO; Provided_By: Subcon; Initial_Board_Reference: MB1319; Internal_Part_Number: MCD-00222; Status: Released; Part_Type: Resistor; Package: R0603; ComponentLink1Description: Yageo_Resistor_RC0603-series.pdf; ComponentLink1URL: http://tunmcdsvn.tun.st.com/Component_Datasheet_Library/Trunk/Resistors/Yageo_Resistor_RC0603-series; ECCN_US: n/a; ECCN_EU: n/a
SB6 SB8 SB10 SB12 SB15 SB17 = MCD-00072: Solder Bridge OFF; Part_Type: Mechanical; Initial_Board_Reference: mb1274; Internal_Part_Number: MCD-00072; Status: Released; ECCN_US: n/a; ECCN_EU: n/a; Provided_By: n/a
SB7 SB9 SB11 SB13 SB14 SB16 SB18 SB19 = MCD-00071: Solder Bridge ON; Part_Type: Mechanical; Provided_By: Subcon; Initial_Board_Reference: mb1274; Internal_Part_Number: MCD-00071; ECCN_US: n/a; ECCN_EU: n/a; Status: Released
T1 = MCD-00073: NPN Bipolar Transistor; Part_Type: IC; Manufacturer: NXP; ECCN_US: EAR99; ECCN_EU: NEC; Provided_By: Subcon; Initial_Board_Reference: mb1274; Revision: *; Internal_Part_Number: MCD-00073; Value: 9013-SOT23; Status: Released; ComponentLink1Description: NXP_Transistor_BSR14.pdf; ComponentLink1URL: http://tunmcdsvn.tun.st.com/Component_Datasheet_Library/Trunk/IC/NXP_Transistor_BSR14.pdf
U1 = MCD-00163: Very low capacitance ESD protection; Part_Type: IC; Manufacturer: STMICROELECTRONICS; ECCN_US: EAR99; ECCN_EU: NEC; Provided_By: Subcon; Initial_Board_Reference: mb1263; Internal_Part_Number: MCD-00163; Value: USBLC6-2SC6; Status: Released; Manufacturer_Part_Number: USBLC6-2SC6; ComponentLink1Description: STM_ESD_USBLC6-2.pdf; ComponentLink1URL: http://tunmcdsvn.tun.st.com/Component_Datasheet_Library/Trunk/Diodes/STM_ESD_USBLC6-2.pdf
U2 = MCD-00085: Medium-density performance line ARM-based 32-bit MCU with 128KB Flash; Manufacturer: STMICROELECTRONICS; Part_Type: IC; ECCN_US: 3A991A2; ECCN_EU: NEC; Provided_By: Subcon; Initial_Board_Reference: mb1274; Value: STM32F103CBT6; Internal_Part_Number: MCD-00085; Manufacturer_Part_Number: STM32F103CBT6; ComponentLink1Description: STM_STM32F103CBT6.pdf; Status: Released; ComponentLink1URL: http://tunmcdsvn.tun.st.com/Component_Datasheet_Library/Trunk/IC/STM_STM32F103CBT6.pdf
U3 = MCD-00663: 200 mA low quiescent current very low noise LDO; Part_Type: IC; Manufacturer: STMICROELECTRONICS; ECCN_US: EAR99; ECCN_EU: NEC; Provided_By: Subcon; Initial_Board_Reference: MB1360; Internal_Part_Number: MCD-00663; Value: LDK120M33R; Status: Footprint available; Manufacturer_Part_Number: LDK120M33R; Package: SOT23-5L; ComponentLink1Description: STM_LDO_LDK120M33R.pdf; ComponentLink1URL: http://tunmcdsvn.tun.st.com/Component_Datasheet_Library/Trunk/IC/STM_LDO_LDK120M33R.pdf
U4 = MCD-00083: Enhanced single channel power switches; Part_Type: IC; Manufacturer: STMICROELECTRONICS; ECCN_US: EAR99; ECCN_EU: NEC; Provided_By: Subcon; Initial_Board_Reference: MB1274; Internal_Part_Number: MCD-00083; Status: Released; Manufacturer_Part_Number: STMPS2141STR; ComponentLink1Description: STM_PWR-Switch_STMPS2141STR.pdf; ComponentLink1URL: http://tunmcdsvn.tun.st.com/Component_Datasheet_Library/Trunk/IC/STM_PWR-Switch_STMPS2141STR
X1 = MCD-00092: Crystal 8Mhz, 8pF, -+50PPM, SMD; Part_Type: Crystal_Osc; Manufacturer_Part_Number: NX3225GD 8MHz EXS00A-CG04874; Manufacturer: NDK; ECCN_US: EAR99; ECCN_EU: NEC; Provided_By: STM; Initial_Board_Reference: mb1274; Internal_Part_Number: MCD-00092; Status: Released; ComponentLink1Description: NDK_Crystal-For-ST_NX3225GD 8MHz EXS00A-CG04874 (EXS10B-20725).pdf; ComponentLink1URL: http://tunmcdsvn.tun.st.com/Component_Datasheet_Library/Trunk/Crystal_Osc/NDK_Crystal-For-ST_NX3225GD 8MHz EXS00A-CG04874 (EXS10B-20725).pdf

## Sheet Arduino_extension_connectors.SchDoc: Connectors
size A4; CompanyName: STMicroelectronics; Organization: Microcontrollers Division; SheetNumber: 5; SheetTotal: 8
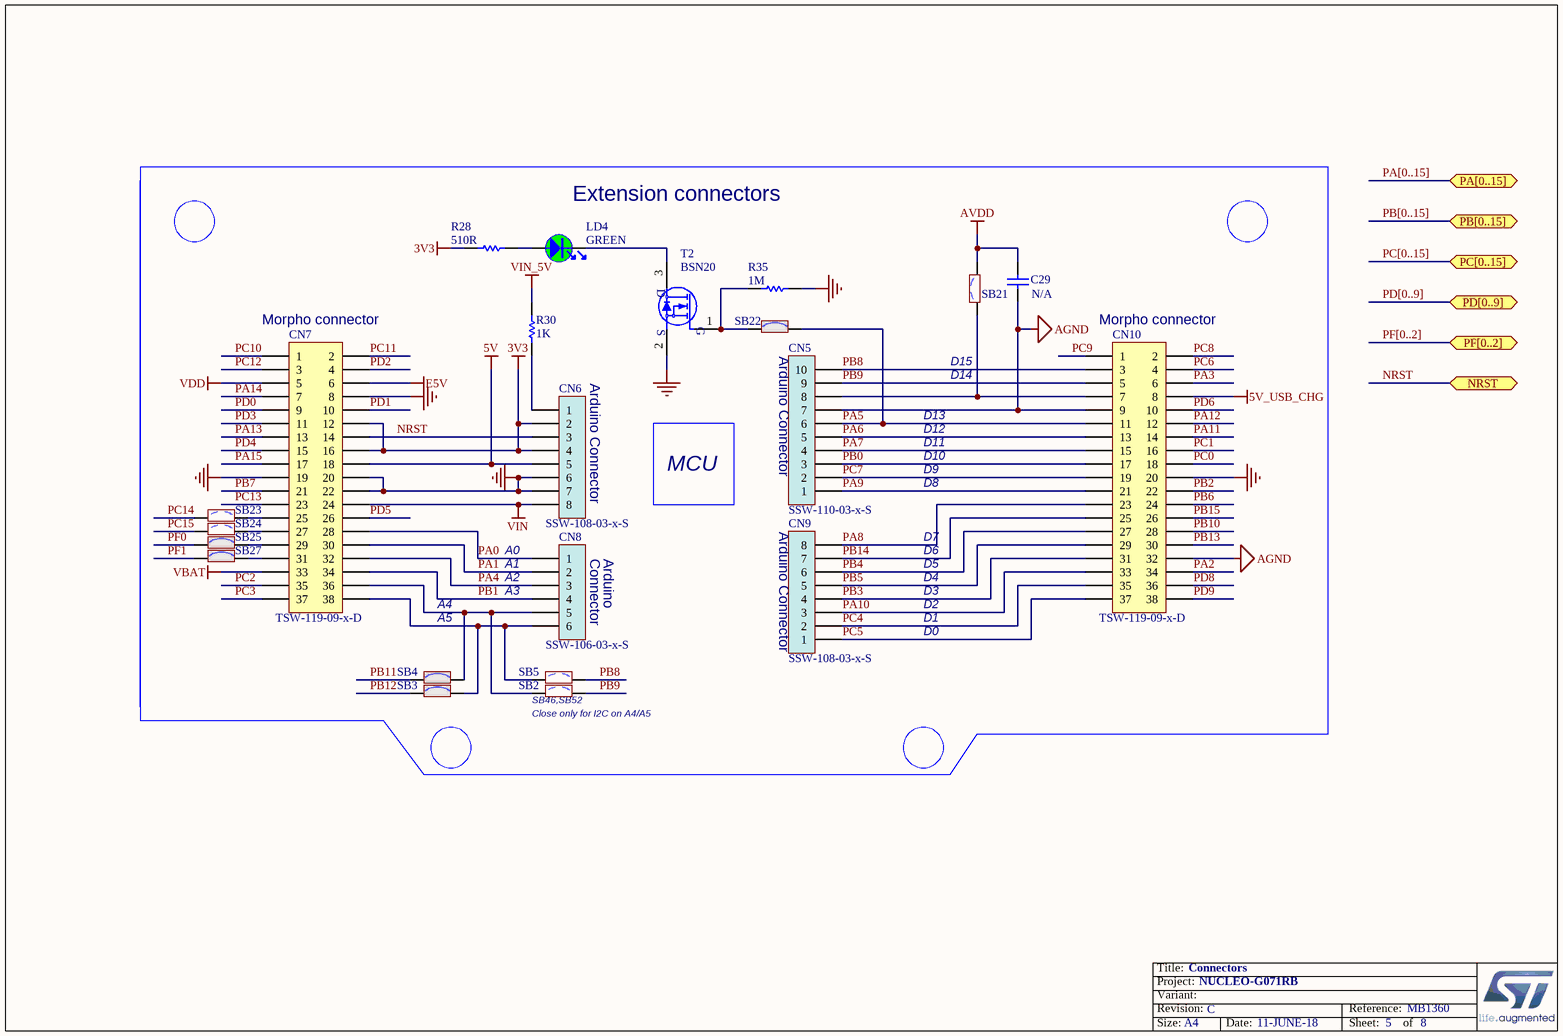
[diagram p3: Arduino_extension_connectors.SchDoc]

### Parts
C29  N/A  [C0603]
CN5  Manufacturer_Part_Number: SSW-110-03-x-S  [CON_SAMTEC_SSW-110-03-X-S]  (hidden comment: Socket 10x1)
CN6  Manufacturer_Part_Number: SSW-108-03-x-S  [CON_SAMTEC_SSW-108-03-X-S]  (hidden comment: Socket 8x1)
CN7  Manufacturer_Part_Number: TSW-119-09-x-D  [CON_SAMTEC_TSW-119-09-X-D]  (hidden comment: Header 19x2)
CN8  Manufacturer_Part_Number: SSW-106-03-x-S  [CON_SAMTEC_SSW-106-03-X-S]  (hidden comment: Socket 6x1)
CN9  Manufacturer_Part_Number: SSW-108-03-x-S  [CON_SAMTEC_SSW-108-03-X-S]  (hidden comment: Socket 8x1)
CN10  Manufacturer_Part_Number: TSW-119-09-x-D  [CON_SAMTEC_TSW-119-09-X-D]  (hidden comment: Header 19x2)
LD4  value GREEN  [LED_0603_GREEN]  (hidden comment: LED_green)
R28  value 510R  [R0603]  (hidden comment: Resistor)
R30  value 1K  [R0603]  (hidden comment: Resistor)
R35  value 1M  [R0603]  (hidden comment: Resistor)
SB2  SB_OFF  [SOLDER-BRIDGE_R0603-0R]  (value not drawn)
SB3  SB_ON  [SOLDER-BRIDGE_R0603-0R]  (value not drawn)
SB4  SB_ON  [SOLDER-BRIDGE_R0603-0R]  (value not drawn)
SB5  SB_OFF  [SOLDER-BRIDGE_R0603-0R]  (value not drawn)
SB21  SB_OFF  [SOLDER-BRIDGE_R0603-0R]  (value not drawn)
SB22  SB_ON  [SOLDER-BRIDGE_R0603-0R]  (value not drawn)
SB23  SB_OFF  [SOLDER-BRIDGE_R0603-0R]  (value not drawn)
SB24  SB_OFF  [SOLDER-BRIDGE_R0603-0R]  (value not drawn)
SB25  SB_ON  [SOLDER-BRIDGE_R0603-0R]  (value not drawn)
SB27  SB_ON  [SOLDER-BRIDGE_R0603-0R]  (value not drawn)
T2  BSN20  [MOS_SOT23]

### Ports
NRST, PA[0..15] (bidir), PB[0..15] (bidir), PC[0..15] (bidir), PD[0..9], PF[0..2] (bidir)

### Nets
3V3: CN6.2 CN6.4 CN7.12 CN7.16 R28.2
5V: CN6.5 CN7.18
5V_USB_CHG: CN10.8
AGND: C29.1 CN5.7 CN10.9 CN10.32
AVDD: C29.2 SB21.2
E5V: CN7.6
GND: CN6.6 CN6.7 CN7.8 CN7.19 CN7.20 CN7.22 CN10.20 R35.2 T2.2(S)
VBAT: CN7.33
VDD: CN7.5
VIN: CN6.8 CN7.24
VIN_5V: R30.1
NRST: CN6.3 CN7.14 ; port NRST
PA0: CN7.28 CN8.1
PA1: CN7.30 CN8.2
PA2: CN10.34
PA3: CN10.6
PA4: CN7.32 CN8.3
PA5: CN5.6 CN10.11 SB22.2
PA6: CN5.5 CN10.13
PA7: CN5.4 CN10.15
PA8: CN9.8 CN10.23
PA9: CN5.1 CN10.21
PA10: CN9.3 CN10.33
PA11: CN10.14
PA12: CN10.12
PA13: CN7.13
PA14: CN7.7
PA15: CN7.17
PB0: CN5.3 CN10.17
PB1: CN7.34 CN8.4
PB2: CN10.22
PB3: CN9.4 CN10.31
PB4: CN9.6 CN10.27
PB5: CN9.5 CN10.29
PB6: CN10.24
PB7: CN7.21
PB8: CN5.10 CN10.3 SB5.2
PB9: CN5.9 CN10.5 SB2.2
PB10: CN10.28
PB11: SB4.1
PB12: SB3.1
PB13: CN10.30
PB14: CN9.7 CN10.25
PB15: CN10.26
PC0: CN10.18
PC1: CN10.16
PC2: CN7.35
PC3: CN7.37
PC4: CN9.2 CN10.35
PC5: CN9.1 CN10.37
PC6: CN10.4
PC7: CN5.2 CN10.19
PC8: CN10.2
PC9: CN10.1
PC10: CN7.1
PC11: CN7.2
PC12: CN7.3
PC13: CN7.23
PC14: SB23.1
PC15: SB24.1
PD0: CN7.9
PD1: CN7.10
PD2: CN7.4
PD3: CN7.11
PD4: CN7.15
PD5: CN7.26
PD6: CN10.10
PD8: CN10.36
PD9: CN10.38
PF0: SB25.1  [project net MCO]
PF1: SB27.1
NetCN5_8: CN5.8 CN10.7 SB21.1
NetCN6_1: CN6.1 R30.2
NetCN7_25: CN7.25 SB23.2
NetCN7_27: CN7.27 SB24.2
NetCN7_29: CN7.29 SB25.2
NetCN7_31: CN7.31 SB27.2
NetCN7_36: CN7.36 CN8.5 SB2.1 SB4.2
NetCN7_38: CN7.38 CN8.6 SB3.2 SB5.1
NetLD4_1: LD4.1 R28.1
NetLD4_2: LD4.2 T2.3(D)
NetR35_1: R35.1 SB22.1 T2.1(G)

### Buses and harness runs
bus PA[0..15] = port PA[0..15]
bus PB[0..15] = port PB[0..15]
bus PC[0..15] = port PC[0..15]
bus PD[0..9] = port PD[0..9]
bus PF[0..2] = port PF[0..2]

### Notes on the sheet
- (near LD4) Extension connectors
- (near CN7) Morpho connector
- (near CN6) Arduino Connector
- Arduino Connector
- D14
- D15
- (near CN10) Morpho connector
- D13
- D12
- D11
- MCU
- D8
- D9
- D10
- A0
- (near CN8) A1
- (near CN8) A2
- (near CN8) Connector
- (near CN8) Arduino
- (near CN9) Arduino Connector
- D4
- D5
- D6
- D7
- A4
- A5
- (near CN8) A3
- D0
- D1
- D2
- D3
- (near SB2) Close only for I2C on A4/A5
- (near SB2) SB46,SB52
- Title:
- Project:
- Size:
- Revision:
- Variant:
- Date:
- Reference:
- Sheet:
- of

### Library data of the parts
C29 = MCD-00211: as C1 on sheet ST_LINK_V2-1; Internal_Part_Number: MCD-00211; Value: 100nF; Status: Released; Part_Type: Capacitor; Package: C0603; ComponentLink1Description: Yageo_Capacitor_X7R-series.pdf; ComponentLink1URL: http://tunmcdsvn.tun.st.com/Component_Datasheet_Library/Trunk/Capacitors/Yageo_Capacitor_X7R-series.pdf; ECCN_US: n/a; ECCN_EU: n/a
CN5 = MCD-00262: Socket, 10x1, 2.54mm, VR, TH, Height 8.51mm/10mm; Manufacturer: SAMTEC; Part_Type: Connector; Provided_By: Subcon; Initial_Board_Reference: mb1319; Internal_Part_Number: MCD-00262; Value: Socket 10x1; ECCN_US: n/a; ECCN_EU: n/a; ComponentLink1Description: Samtec_SSW-SSQ-series.pdf; Status: Released; ComponentLink1URL: http://tunmcdsvn.tun.st.com/Component_Datasheet_Library/Trunk/Connectors/Samtec_SSW-SSQ-series.pdf
CN6 = MCD-00261: Socket, 8x1, 2.54mm, VR, TH, Height 8.51mm/10mm; Manufacturer: SAMTEC; Part_Type: Connector; Provided_By: Subcon; Initial_Board_Reference: mb1319; Internal_Part_Number: MCD-00261; Value: Socket 8x1; ECCN_US: n/a; ECCN_EU: n/a; ComponentLink1Description: Samtec_SSW-SSQ-series.pdf; Status: Released; ComponentLink1URL: http://tunmcdsvn.tun.st.com/Component_Datasheet_Library/Trunk/Connectors/Samtec_SSW-SSQ-series.pdf
CN7 CN10 = MCD-00213: Header, 19x2, 2,54mm, VR, TH, Height 5.84mm/10.16mm; Manufacturer: SAMTEC; Part_Type: Connector; Provided_By: Subcon; Initial_Board_Reference: mb1319; Internal_Part_Number: MCD-00213; Value: Header 19x2; ECCN_US: n/a; ECCN_EU: n/a; ComponentLink1Description: Samtec_connector_TSW-HTSW-series.pdf; Status: Released; ComponentLink1URL: http://tunmcdsvn.tun.st.com/Component_Datasheet_Library/Trunk/Connectors/Samtec_connector_TSW-HTSW-series.pdf
CN8 = MCD-00260: Socket, 6x1, 2.54mm, VR, TH, Height 8.51mm/10mm; Part_Type: Connector; Manufacturer: SAMTEC; Provided_By: Subcon; Initial_Board_Reference: mb1319; Internal_Part_Number: MCD-00260; Value: Socket 6x1; Status: Released; ComponentLink1Description: Samtec_SSW-SSQ-series.pdf; ComponentLink1URL: http://tunmcdsvn.tun.st.com/Component_Datasheet_Library/Trunk/Connectors/Samtec_SSW-SSQ-series.pdf; ECCN_US: n/a; ECCN_EU: n/a
CN9 = MCD-00261: Socket, 8x1, 2.54mm, VR, TH, Height 8.51mm/10mm; Part_Type: Connector; Manufacturer: SAMTEC; Provided_By: Subcon; Initial_Board_Reference: mb1319; Internal_Part_Number: MCD-00261; Value: Socket 8x1; Status: Released; ComponentLink1Description: Samtec_SSW-SSQ-series.pdf; ComponentLink1URL: http://tunmcdsvn.tun.st.com/Component_Datasheet_Library/Trunk/Connectors/Samtec_SSW-SSQ-series.pdf; ECCN_US: n/a; ECCN_EU: n/a
LD4 = MCD-00050: LED, Green, 0603; Part_Type: Display; Manufacturer_Part_Number: 19-213SYGC/S530-E2/TR8; Manufacturer: EVERLIGHT; ECCN_US: EAR99; ECCN_EU: NEC; Provided_By: Subcon; Initial_Board_Reference: mb1274; Internal_Part_Number: MCD-00050; Status: Released; ComponentLink1Description: Everlight_SMD-LED-GREEN_19-213SYGC-S530-XX-TR8-v3.doc.pdf; ComponentLink1URL: http://tunmcdsvn.tun.st.com/Component_Datasheet_Library/Trunk/display/Everlight_SMD-LED-GREEN_19-213SYGC-S530-XX-TR8-v3.doc.pdf
R28 = MCD-00225: Resistor,510R,0603,1%,1/10W; Manufacturer_Part_Number: RC0603FR-07510RL; Manufacturer: YAGEO; Provided_By: Subcon; Initial_Board_Reference: mb1319; Internal_Part_Number: MCD-00225; ECCN_US: n/a; ECCN_EU: n/a; ComponentLink1Description: Yageo_Resistor_RC0603-series.pdf; Status: Released; Part_Type: Resistor; Package: R0603; ComponentLink1URL: http://tunmcdsvn.tun.st.com/Component_Datasheet_Library/Trunk/Resistors/Yageo_Resistor_RC0603-series.pdf
R30 = MCD-00070: as R18 on sheet ST_LINK_V2-1; Internal_Part_Number: MCD-00070; Status: Released; Part_Type: Resistor; Package: R0603; ComponentLink1Description: Yageo_Resistor_RC0603-series.pdf; ComponentLink1URL: http://tunmcdsvn.tun.st.com/Component_Datasheet_Library/Trunk/Resistors/Yageo_Resistor_RC0603-series.pdf; ECCN_US: n/a; ECCN_EU: n/a
R35 = MCD-00257: Resistor,1M,0603,1%,1/10W; Manufacturer_Part_Number: RC0603FR-071ML; Manufacturer: YAGEO; Provided_By: Subcon; Initial_Board_Reference: mb1319; Internal_Part_Number: MCD-00257; Status: Released; Part_Type: Resistor; Package: R0603; ComponentLink1Description: Yageo_Resistor_RC0603-series.pdf; ComponentLink1URL: http://tunmcdsvn.tun.st.com/Component_Datasheet_Library/Trunk/Resistors/Yageo_Resistor_RC0603-series.pdf; ECCN_US: n/a; ECCN_EU: n/a
SB2 SB5 SB21 SB23 SB24 = MCD-00072: as SB6 on sheet ST_LINK_V2-1; Internal_Part_Number: MCD-00072; Status: Released; ECCN_US: n/a; ECCN_EU: n/a; Provided_By: n/a
SB3 SB4 SB22 SB25 SB27 = MCD-00071: as SB7 on sheet ST_LINK_V2-1; Internal_Part_Number: MCD-00071; ECCN_US: n/a; ECCN_EU: n/a; Status: Released
T2 = MCD-00151: N-channel enhancement mode field-effect transistor; Part_Type: IC; Manufacturer: NXP; ECCN_US: EAR99; ECCN_EU: NEC; Provided_By: Subcon; Initial_Board_Reference: mb1262; Internal_Part_Number: MCD-00151; Value: BSN20; Status: Released; Manufacturer_Part_Number: BSN20; ComponentLink1Description: NXP_Transistor_BSN20BK_SOT23.pdf; ComponentLink1URL: http://tunmcdsvn.tun.st.com/Component_Datasheet_Library/Trunk/IC/NXP_Transistor_BSN20BK_SOT23.pdf

## Sheet STM32_microcontroller_IOs.SchDoc: STM32_microcontroller_IOs
size A4; CompanyName: STMicroelectronics; Organization: Microcontrollers Division; SheetNumber: 3; SheetTotal: 8
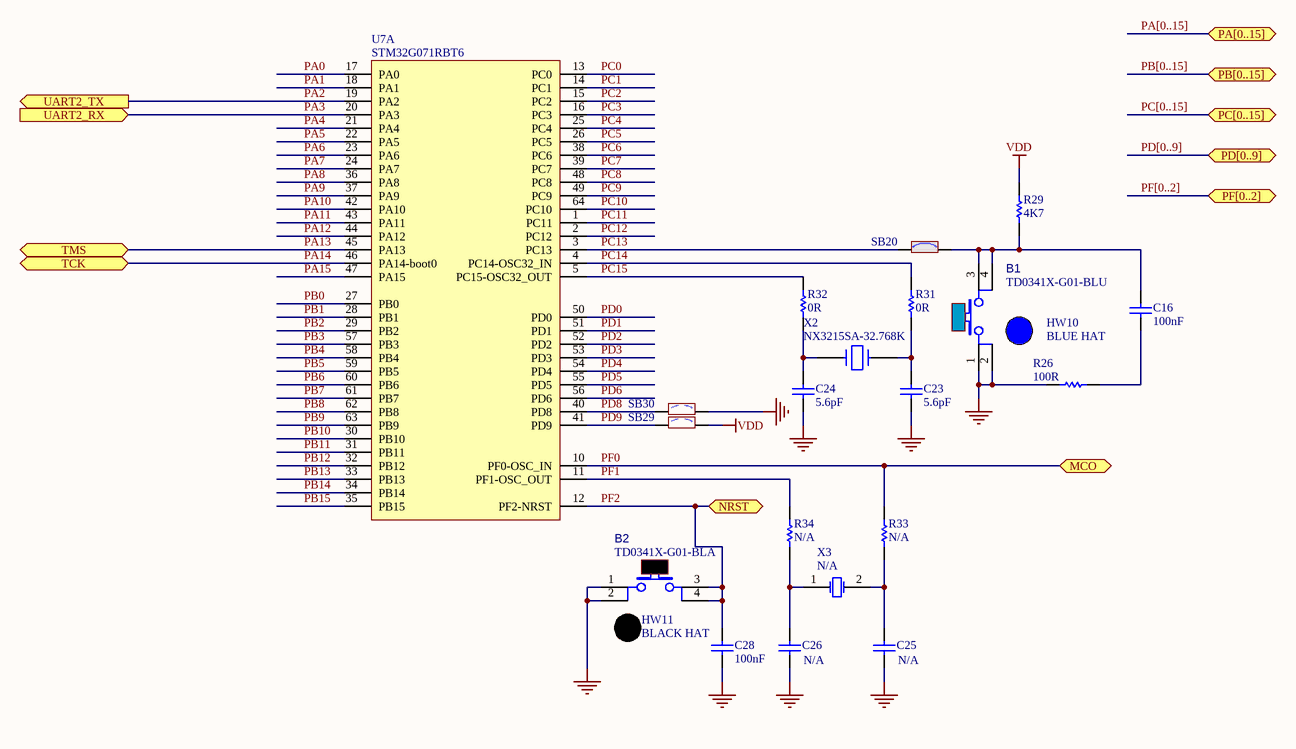
[diagram p4: STM32_microcontroller_IOs.SchDoc]

### Parts
B1  Manufacturer_Part_Number: TD0341X-G01-BLU  [SWI_WEALTHMETAL_TD-0341_4P_BLUE]  (hidden comment: SW-PUSH-CMS_BLUE)
B2  Manufacturer_Part_Number: TD0341X-G01-BLA  [SWI_WEALTHMETAL_TD-0341_4P_BLACK]  (hidden comment: SW-PUSH-CMS_BLACK)
C16  value 100nF  [C0603]  (hidden comment: Capacitor)
C23  value 5.6pF  [C0603]  (hidden comment: Capacitor)
C24  value 5.6pF  [C0603]  (hidden comment: Capacitor)
C25  N/A  [C0603]
C26  N/A  [C0603]
C28  value 100nF  [C0603]  (hidden comment: Capacitor)
HW10  value BLUE HAT  (hidden comment: BUTTON_HAT_BLUE)  (mechanical)
HW11  value BLACK HAT  (hidden comment: BUTTON_HAT_BLACK)  (mechanical)
R26  value 100R  [R0603]  (hidden comment: Resistor)
R29  value 4K7  [R0603]  (hidden comment: Resistor)
R31  value 0R  [R0603]  (hidden comment: Resistor)
R32  value 0R  [R0603]  (hidden comment: Resistor)
R33  N/A  [R0603]
R34  N/A  [R0603]
SB20  SB_ON  [SOLDER-BRIDGE_R0603-0R]  (value not drawn)
SB29  SB_OFF  [SOLDER-BRIDGE_R0603-0R]  (value not drawn)
SB30  SB_OFF  [SOLDER-BRIDGE_R0603-0R]  (value not drawn)
U7  STM32G071RBT6  [ICC_LQFP64_10X10_P050_SOCKET_YAMAICHI_IC149-064-069-B5]  (part A of 2)
X2  value NX3215SA-32.768K  [CRY_NX3215SA_2P]  (hidden comment: XTAL_32K_NX3215SA)
X3  N/A  [CRY_NX3225GD_2P]

### Ports
MCO, NRST, PA[0..15] (bidir), PB[0..15] (bidir), PC[0..15] (bidir), PD[0..9], PF[0..2] (bidir), TCK, TMS, UART2_RX (in), UART2_TX (out)

### Nets
GND: B1.1 B1.2 B2.1 B2.2 C23.1 C24.1 C25.1 C26.1 C28.1 R26.1 SB30.2
VDD: R29.2 SB29.2
PA0: U7.17(PA0)
PA1: U7.18(PA1)
PA2: U7.19(PA2) ; port UART2_TX
PA3: U7.20(PA3) ; port UART2_RX
PA4: U7.21(PA4)
PA5: U7.22(PA5)
PA6: U7.23(PA6)
PA7: U7.24(PA7)
PA8: U7.36(PA8)
PA9: U7.37(PA9)
PA10: U7.42(PA10)
PA11: U7.43(PA11)
PA12: U7.44(PA12)
PA13: U7.45(PA13) ; port TMS
PA14: U7.46(PA14-boot0) ; port TCK
PA15: U7.47(PA15)
PB0: U7.27(PB0)
PB1: U7.28(PB1)
PB2: U7.29(PB2)
PB3: U7.57(PB3)
PB4: U7.58(PB4)
PB5: U7.59(PB5)
PB6: U7.60(PB6)
PB7: U7.61(PB7)
PB8: U7.62(PB8)
PB9: U7.63(PB9)
PB10: U7.30(PB10)
PB11: U7.31(PB11)
PB12: U7.32(PB12)
PB13: U7.33(PB13)
PB14: U7.34(PB14)
PB15: U7.35(PB15)
PC0: U7.13(PC0)
PC1: U7.14(PC1)
PC2: U7.15(PC2)
PC3: U7.16(PC3)
PC4: U7.25(PC4)
PC5: U7.26(PC5)
PC6: U7.38(PC6)
PC7: U7.39(PC7)
PC8: U7.48(PC8)
PC9: U7.49(PC9)
PC10: U7.64(PC10)
PC11: U7.1(PC11)
PC12: U7.2(PC12)
PC13: SB20.1 U7.3(PC13)
PC14: R31.1 U7.4(PC14-OSC32_IN)
PC15: R32.1 U7.5(PC15-OSC32_OUT)
PD0: U7.50(PD0)
PD1: U7.51(PD1)
PD2: U7.52(PD2)
PD3: U7.53(PD3)
PD4: U7.54(PD4)
PD5: U7.55(PD5)
PD6: U7.56(PD6)
PD8: SB30.1 U7.40(PD8)
PD9: SB29.1 U7.41(PD9)
PF0: R33.1 U7.10(PF0-OSC_IN) ; port MCO  [project net MCO]
PF1: R34.1 U7.11(PF1-OSC_OUT)
PF2: B2.3 B2.4 C28.2 U7.12(PF2-NRST) ; port NRST  [project net NRST]
NetB1_3: B1.3 B1.4 C16.2 R29.1 SB20.2
NetC16_1: C16.1 R26.2
NetC23_2: C23.2 R31.2 X2.2
NetC24_2: C24.2 R32.2 X2.1
NetC25_2: C25.2 R33.2 X3.2(OSC2)
NetC26_2: C26.2 R34.2 X3.1(OSC1)

### Buses and harness runs
bus PA[0..15] = port PA[0..15]
bus PB[0..15] = port PB[0..15]
bus PC[0..15] = port PC[0..15]
bus PD[0..9] = port PD[0..9]
bus PF[0..2] = port PF[0..2]

### Notes on the sheet
- Title:
- Project:
- Size:
- Revision:
- Variant:
- A4
- Date:
- Reference:
- Sheet:
- of

### Library data of the parts
B1 = MCD-00002: Non-Open Push-Button 0.1A 24V; Part_Type: Misc; Manufacturer: WEALTHMETAL; Value: SW_BLUE; Provided_By: Subcon; Initial_Board_Reference: mb1274; Internal_Part_Number: MCD-00002; Status: Released; ComponentLink1Description: Wealthmetal_Tact-Switch_TD0341.pdf; ComponentLink1URL: http://tunmcdsvn.tun.st.com/Component_Datasheet_Library/Trunk/Misc/Wealthmetal_Tact-Switch_TD0341.pdf; Order_Code_Farnell: 535-930; ECCN_US: n/a; ECCN_EU: n/a
B2 = MCD-00001: Non-Open Push-Button 0.1A 24V; Part_Type: Misc; Manufacturer: WEALTHMETAL; Value: SW_BLACK; Provided_By: Subcon; Initial_Board_Reference: mb1274; Internal_Part_Number: MCD-00001; Status: Released; ComponentLink1Description: Wealthmetal_Tact-Switch_TD0341.pdf; ComponentLink1URL: http://tunmcdsvn.tun.st.com/Component_Datasheet_Library/Trunk/Misc/Wealthmetal_Tact-Switch_TD0341.pdf; Order_Code_Farnell: 535-930; ECCN_US: n/a; ECCN_EU: n/a
C16 C28 = MCD-00211: as C1 on sheet ST_LINK_V2-1; Internal_Part_Number: MCD-00211; Status: Released; Part_Type: Capacitor; Package: C0603; ComponentLink1Description: Yageo_Capacitor_X7R-series.pdf; ComponentLink1URL: http://tunmcdsvn.tun.st.com/Component_Datasheet_Library/Trunk/Capacitors/Yageo_Capacitor_X7R-series.pdf; ECCN_US: n/a; ECCN_EU: n/a
C23 C24 = MCD-00666: Capacitor,5.6pF,0.1pF,16V,NPO,0603; Manufacturer_Part_Number: CC0603BRNPO7BN5R6; Manufacturer: YAGEO; Provided_By: Subcon; Initial_Board_Reference: MB1360; Internal_Part_Number: MCD-00666; Status: Footprint available; Part_Type: Capacitor; Package: C0603; ComponentLink1Description: Yageo_Capacitor_NP0_16V-to-50V.pdf; ComponentLink1URL: http://tunmcdsvn.tun.st.com/Component_Datasheet_Library/Trunk/Capacitors/Yageo_Capacitor_NP0_16V-to-50V; ECCN_US: n/a; ECCN_EU: n/a
C25 C26 = MCD-00637: as C4 on sheet ST_LINK_V2-1; Internal_Part_Number: MCD-00637; Value: 10pF; Status: Released; Part_Type: Capacitor; Package: C0603; ComponentLink1Description: Yageo_Capacitor_NP0_16V-to-50V.pdf; ComponentLink1URL: http://tunmcdsvn.tun.st.com/Component_Datasheet_Library/Trunk/Capacitors/Yageo_Capacitor_NP0_16V-to-50V.pdf; ECCN_US: n/a; ECCN_EU: n/a
HW10 = MCD-00634: Blue Hat for switch TD0341X-G01-BLU; Part_Type: Mechanical; Manufacturer_Part_Number: 988.16.09.3.00002_SH-517; Manufacturer: JIUBABA; Provided_By: Subcon; Initial_Board_Reference: mb1319; Internal_Part_Number: MCD-00634; Status: Released; ECCN_US: n/a; ECCN_EU: n/a; ComponentLink1Description: Juibaba_HAT_SH-517.pdf; ComponentLink1URL: http://tunmcdsvn.tun.st.com/Component_Datasheet_Library/Trunk/Mechanical/Juibaba_HAT_SH-517.pdf
HW11 = MCD-00635: Black Hat for switch TD0341X-G01-BLA; Part_Type: Mechanical; Manufacturer_Part_Number: 988.16.09.3.00003_SH-517; Manufacturer: JIUBABA; Provided_By: Subcon; Initial_Board_Reference: mb1319; Internal_Part_Number: MCD-00635; Status: Released; ECCN_US: n/a; ECCN_EU: n/a; ComponentLink1Description: Juibaba_HAT_SH-517.pdf; ComponentLink1URL: http://tunmcdsvn.tun.st.com/Component_Datasheet_Library/Trunk/Mechanical/Juibaba_HAT_SH-517.pdf
R26 R33 R34 = MCD-00224: as R13 on sheet ST_LINK_V2-1; Internal_Part_Number: MCD-00224; Status: Released; Part_Type: Resistor; Package: R0603; ComponentLink1Description: Yageo_Resistor_RC0603-series.pdf; ComponentLink1URL: http://tunmcdsvn.tun.st.com/Component_Datasheet_Library/Trunk/Resistors/Yageo_Resistor_RC0603-series.pdf; ECCN_US: n/a; ECCN_EU: n/a
  R33 R34: Value: 100R
R29 = MCD-00219: as R6 on sheet ST_LINK_V2-1; Internal_Part_Number: MCD-00219; Status: Released; Part_Type: Resistor; Package: R0603; ComponentLink1Description: Yageo_Resistor_RC0603-series.pdf; ComponentLink1URL: http://tunmcdsvn.tun.st.com/Component_Datasheet_Library/Trunk/Resistors/Yageo_Resistor_RC0603-series.pdf; ECCN_US: n/a; ECCN_EU: n/a
R31 R32 = MCD-00181: Resistor,0R,0603,ULO; Manufacturer_Part_Number: PMR03EZPJ000; Manufacturer: ROHM; Provided_By: Subcon; Internal_Part_Number: MCD-00181; Status: Released; Part_Type: Resistor; Package: R0603; ComponentLink1Description: ROHM_ULtra low Ohmic Resistor _PMR10EZPJ000.pdf; ComponentLink1URL: http://tunmcdsvn.tun.st.com/Component_Datasheet_Library/Trunk/Resistors/ROHM_ULtra low Ohmic Resistor _PMR10EZPJ000.pdf; ECCN_US: n/a; ECCN_EU: n/a
SB20 = MCD-00071: as SB7 on sheet ST_LINK_V2-1; Internal_Part_Number: MCD-00071; ECCN_US: n/a; ECCN_EU: n/a; Status: Released
SB29 SB30 = MCD-00072: as SB6 on sheet ST_LINK_V2-1; Internal_Part_Number: MCD-00072; Status: Released; ECCN_US: n/a; ECCN_EU: n/a; Provided_By: n/a
U7 = MCD-00662: Medium-density performance line ARM-based 32-bit MCU with 128KB Flash; Part_Type: IC; Manufacturer: STMICROELECTRONICS; ECCN_US: 3A991A2; ECCN_EU: NEC; Provided_By: STM; Initial_Board_Reference: MB1360; Internal_Part_Number: MCD-00662; Value: STM32G071RBT6; Status: Footprint available; Manufacturer_Part_Number: STM32G071RBT6; Package: LQFP64; ComponentLink1Description: STM_POA_ LQFP 10x10 64L.pdf; ComponentLink1URL: http://tunmcdsvn.tun.st.com/Component_Datasheet_Library/Trunk/IC/STM_POA_ LQFP 10x10 64L.pdf
X2 = MCD-00091: Crystal 32.768kHz, 6pF, -+20PPM, R=50K, SMD; Part_Type: Crystal_Osc; Manufacturer_Part_Number: NX3215SA 32.768KHz EXS00A-MU00525; Manufacturer: NDK; ECCN_US: EAR99; ECCN_EU: NEC; Provided_By: STM; Initial_Board_Reference: mb1274; Internal_Part_Number: MCD-00091; Status: Released; ComponentLink1Description: NDK_Crystal-For-ST_NX3215SA 32.768KHz EXS00A-MU00525 (EXS10B-21238).pdf; ComponentLink1URL: http://tunmcdsvn.tun.st.com/Component_Datasheet_Library/Trunk/Crystal_Osc/NDK_Crystal-For-ST_NX3215SA 32.768KHz EXS00A-MU00525 (EXS10B-21238).pdf
X3 = MCD-00092: Crystal 8Mhz, 8pF, -+50PPM, SMD; Part_Type: Crystal_Osc; Manufacturer_Part_Number: NX3225GD 8MHz EXS00A-CG04874; Manufacturer: NDK; Value: NX3225GD-8.00M; ECCN_US: EAR99; ECCN_EU: NEC; Provided_By: STM; Initial_Board_Reference: mb1274; Internal_Part_Number: MCD-00092; Status: Released; ComponentLink1Description: NDK_Crystal-For-ST_NX3225GD 8MHz EXS00A-CG04874 (EXS10B-20725).pdf; ComponentLink1URL: http://tunmcdsvn.tun.st.com/Component_Datasheet_Library/Trunk/Crystal_Osc/NDK_Crystal-For-ST_NX3225GD 8MHz EXS00A-CG04874 (EXS10B-20725).pdf